# Altium project Sensor_Box_Ethernet.PrjPCB
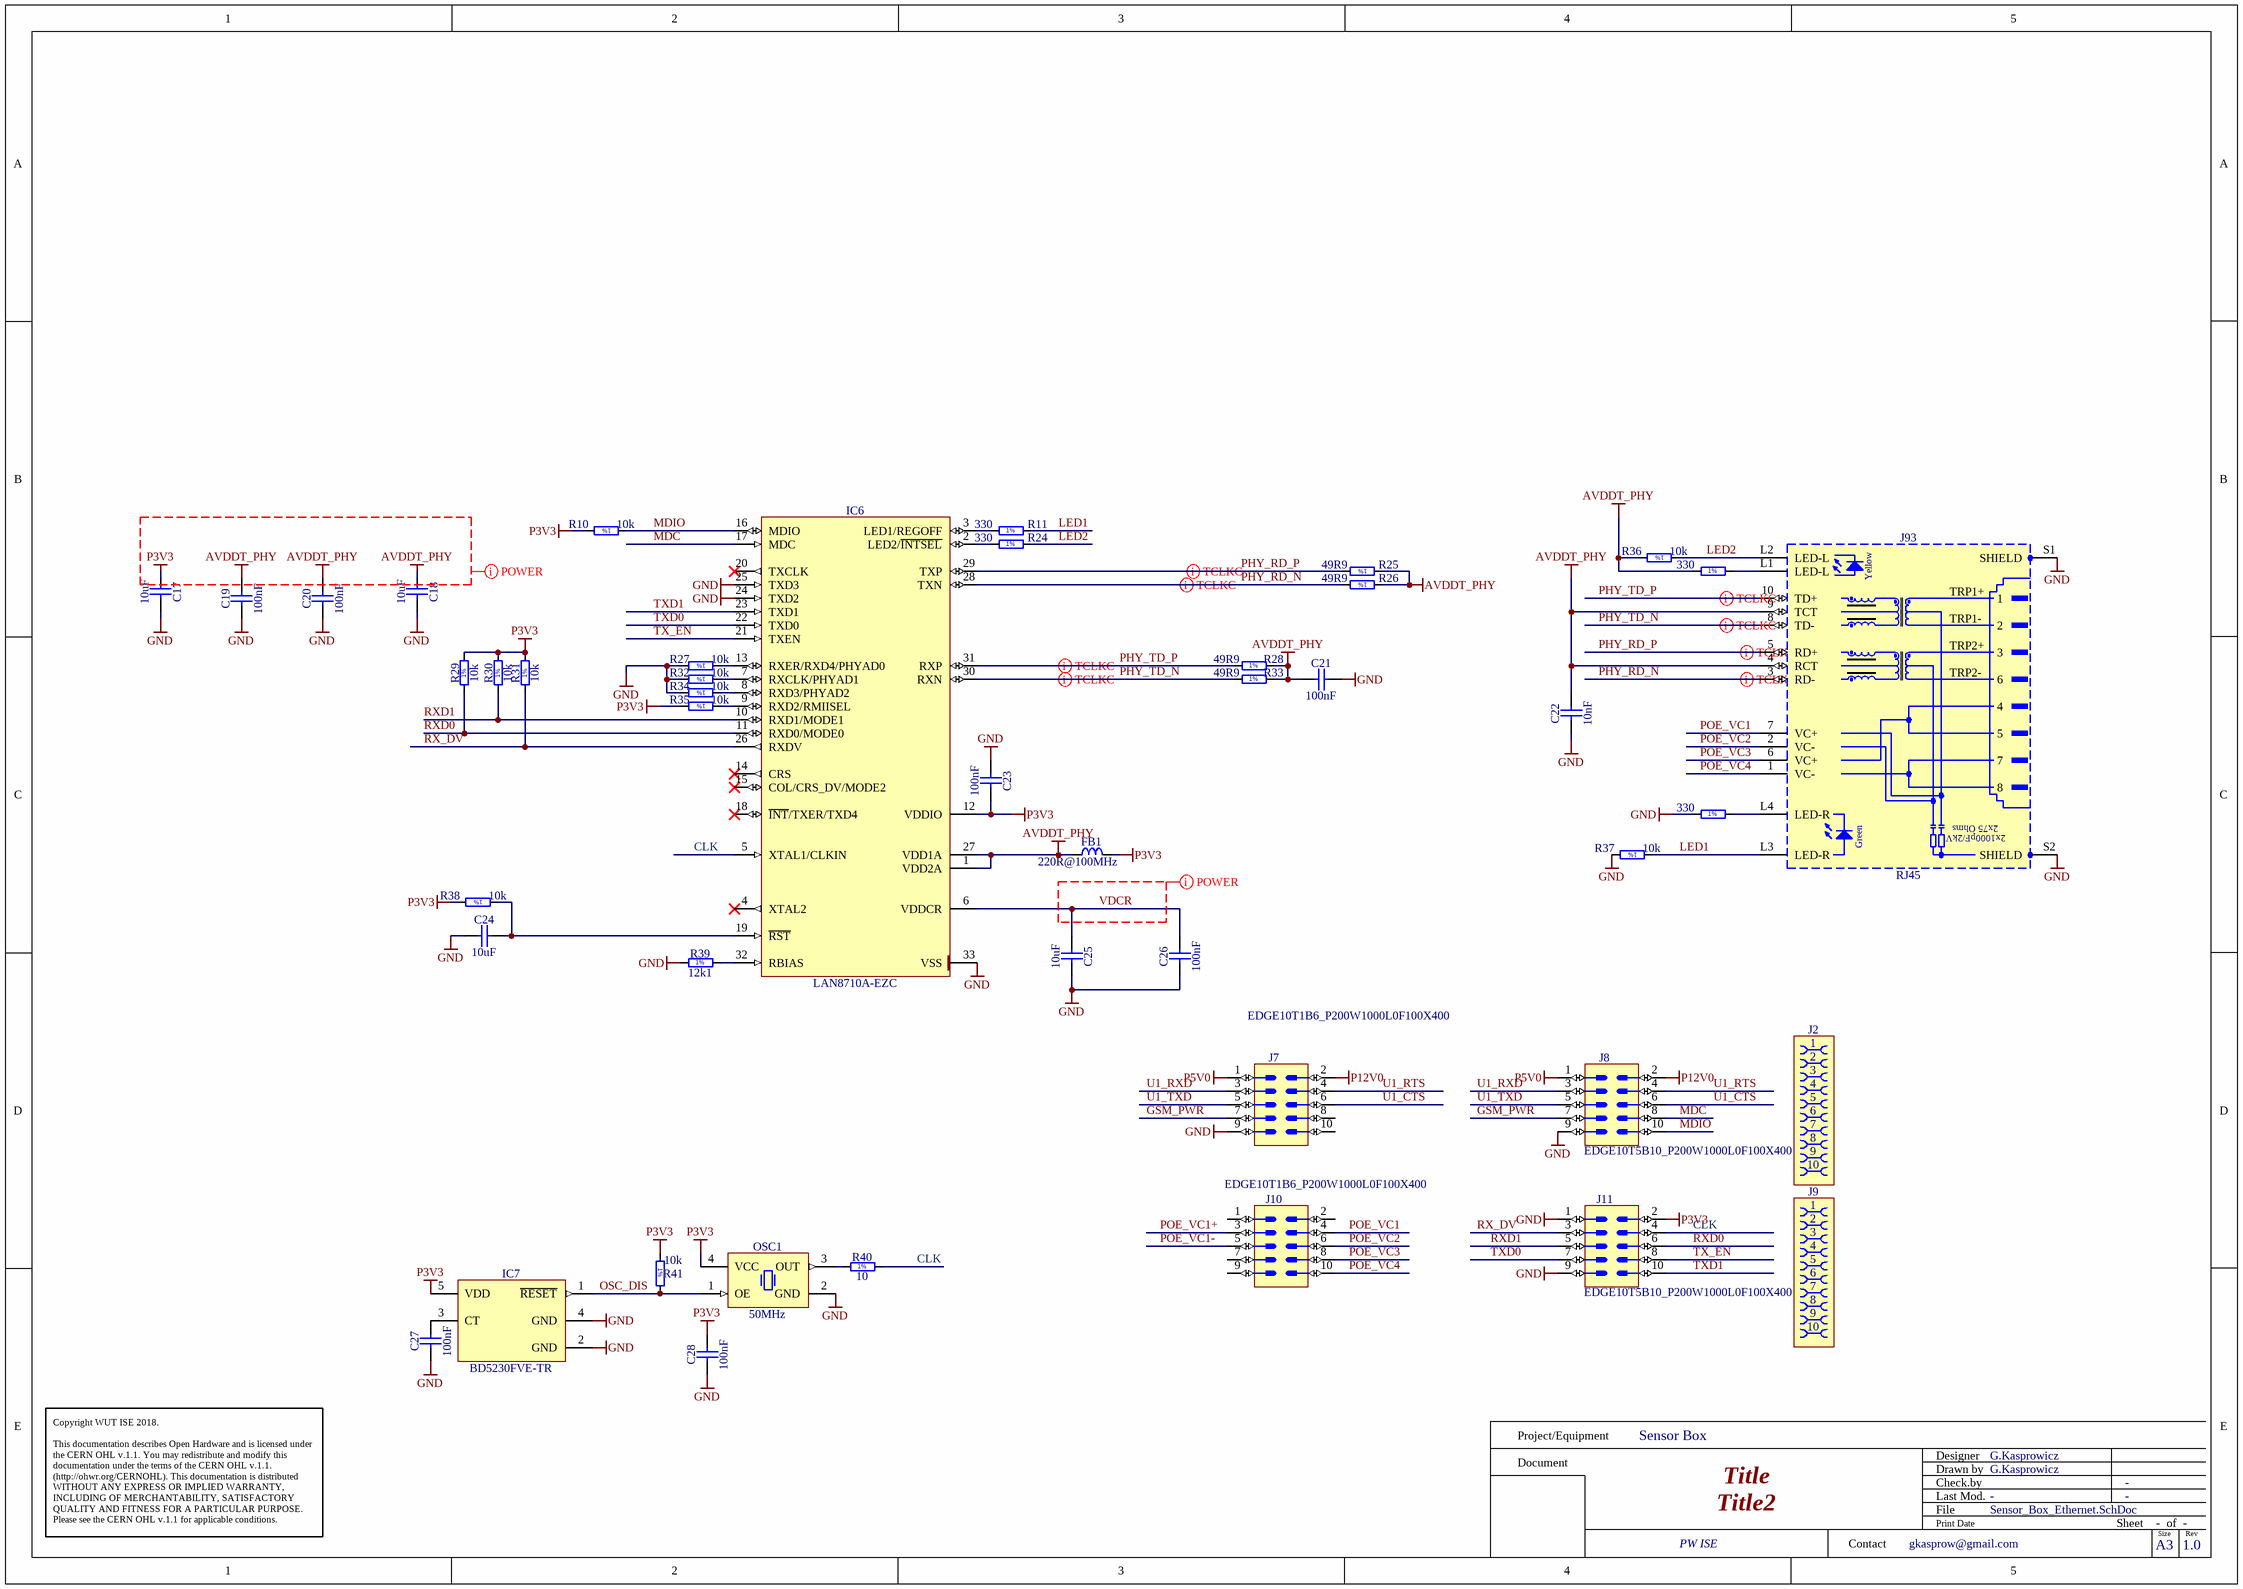
[diagram p0: Sensor_Box_Ethernet.SchDoc]
1 sheet, 45 parts. Net scope: global (net labels, ports and power ports of the same name join across sheets).
Board file: Sensor_Box_Ethernet.PCBDOC

## Sheet Sensor_Box_Ethernet.SchDoc: Title
size 420 x 297 mm; Author: G.Kasprowicz; CompanyName: WUT ISE; DrawnBy: G.Kasprowicz; Organization: WUT ISE; Address1: PW ISE; Address2: Nowowiejska 15/19 00-665 Warsaw; Address3: gkasprow@gmail.com; Revision: 1.0; SheetNumber: -; SheetTotal: -; ModifiedBy: -; CheckedDate: -; Title2: Title2; DivGrp: WUT ISE; Designer: G.Kasprowicz; ModifiedDate: -; ProjectName: Sensor Box

### Parts
C17  10uF  [CAPC2012X135N]
C18  10uF  [CAPC2012X135N]
C19  100nF  [CAPC1005X55N]
C20  100nF  [CAPC1005X55N]
C21  100nF  [CAPC1005X55N]
C22  10nF  [CAPC1608X87N]
C23  100nF  [CAPC1005X55N]
C24  10uF  [CAPC2012X135N]
C25  10uF  [CAPC2012X135N]
C26  100nF  [CAPC1005X55N]
C27  100nF  [CAPC1005X55N]
C28  100nF  [CAPC1005X55N]
FB1  220R@100MHz  [INDC2012X105N]
IC6  LAN8710A-EZC  [QFN50P500X500X100-33N-S340]
IC7  BD5230FVE-TR  [SOT95P280X145-5N]
J2  (no value)  [AVX_00 9159 010 061 916]
J7  (no value)  [EDGE10T1B6_P200W1000L0F100X400]
J8  (no value)  [EDGE10T5B10_P200W1000L0F100X400]
J9  (no value)  [AVX_00 9159 010 061 916]
J10  (no value)  [EDGE10T1B6_P200W1000L0F100X400]
J11  (no value)  [EDGE10T5B10_P200W1000L0F100X400]
J93  RJ45  [ABRACON_ARJM11C7-114-BA-EW2]
OSC1  50MHz  [OSCSC254P320X500X130-4N]
R10  10k  [RESC1005X40N]
R11  330  [RESC1005X40N]
R24  330  [RESC1005X40N]
R25  49R9  [RESC1005X40N]
R26  49R9  [RESC1005X40N]
R27  10k  [RESC1005X40N]
R28  49R9  [RESC1005X40N]
R29  10k  [RESC1005X40N]
R30  10k  [RESC1005X40N]
R31  10k  [RESC1005X40N]
R32  10k  [RESC1005X40N]
R33  49R9  [RESC1005X40N]
R34  10k  [RESC1005X40N]
R35  10k  [RESC1005X40N]
R36  10k  [RESC1005X40N]
R37  10k  [RESC1005X40N]
R38  10k  [RESC1005X40N]
R39  12k1  [RESC1005X40N]
R40  10  [RESC1005X40N]
R41  10k  [RESC1005X40N]
R85  330  [RESC1005X40N]
R86  330  [RESC1005X40N]

### Nets
AVDDT_PHY: C18.1 C19.2 C20.2 C21.1 C22.2 FB1.1 IC6.1(VDD2A) IC6.27(VDD1A) J93.4(RCT) J93.9(TCT) R25.1 R26.1 R28.2 R33.2 R36.2 R85.1
GND: C17.2 C18.2 C19.1 C20.1 C21.2 C22.1 C23.1 C24.1 C25.2 C26.1 C27.1 C28.1 IC6.24(TXD2) IC6.25(TXD3) IC6.33(VSS) IC7.2(GND) IC7.4(GND) J7.9 J8.9 J11.1 J11.9 J93.S1(SHIELD) J93.S2(SHIELD) OSC1.2(GND) R27.2 R32.2 R34.2 R37.2 R39.1 R86.1
P3V3: C17.1 C23.2 C28.2 FB1.2 IC6.12(VDDIO) IC7.5(VDD) J11.2 OSC1.4(VCC) R10.2 R29.2 R30.2 R31.2 R35.2 R38.2 R41.1
P5V0: J7.1 J8.1
P12V0: J7.2 J8.2
CLK: IC6.5(XTAL1/CLKIN) J11.4 R40.2
GSM_PWR: J7.7 J8.7
LED1: J93.L3(LED-R) R11.2 R37.1
LED2: J93.L2(LED-L) R24.2 R36.1
MDC: IC6.17(MDC) J8.8
MDIO: IC6.16(MDIO) J8.10 R10.1
OSC_DIS: IC7.1(~{RESET}) OSC1.1(OE) R41.2
PHY_RD_N: IC6.28(TXN) J93.3(RD-) R26.2
PHY_RD_P: IC6.29(TXP) J93.5(RD+) R25.2
PHY_TD_N: IC6.30(RXN) J93.8(TD-) R33.1
PHY_TD_P: IC6.31(RXP) J93.10(TD+) R28.1
POE_VC1: J10.4 J93.7(VC+)
POE_VC1+: J10.3
POE_VC1-: J10.5
POE_VC2: J10.6 J93.2(VC-)
POE_VC3: J10.8 J93.6(VC+)
POE_VC4: J10.10 J93.1(VC-)
RX_DV: IC6.26(RXDV) J11.3 R31.1
RXD0: IC6.11(RXD0/MODE0) J11.6 R29.1
RXD1: IC6.10(RXD1/MODE1) J11.5 R30.1
TX_EN: IC6.21(TXEN) J11.8
TXD0: IC6.22(TXD0) J11.7
TXD1: IC6.23(TXD1) J11.10
U1_CTS: J7.6 J8.6
U1_RTS: J7.4 J8.4
U1_RXD: J7.3 J8.3
U1_TXD: J7.5 J8.5
VDCR: C25.1 C26.2 IC6.6(VDDCR)
NetC24_2: C24.2 IC6.19(~{RST}) R38.1
NetC27_2: C27.2 IC7.3(CT)
NetIC6_2: IC6.2(LED2/~{INTSEL}) R24.1
NetIC6_3: IC6.3(LED1/REGOFF) R11.1
NetIC6_7: IC6.7(RXCLK/PHYAD1) R32.1
NetIC6_8: IC6.8(RXD3/PHYAD2) R34.1
NetIC6_9: IC6.9(RXD2/RMIISEL) R35.1
NetIC6_13: IC6.13(RXER/RXD4/PHYAD0) R27.1
NetIC6_32: IC6.32(RBIAS) R39.2
NetJ93_L1: J93.L1(LED-L) R85.2
NetJ93_L4: J93.L4(LED-R) R86.2
NetOSC1_3: OSC1.3(OUT) R40.1

Not connected (* = marked no-connect by the designer): IC6 4(XTAL2)* 14(CRS)* 15(COL/CRS_DV/MODE2)* 18(~{INT}/TXER/TXD4)* 20(TXCLK)*; J7 8 10; J10 1 2 7 9

### Layout directives
differential pair: PHY_RD_N, PHY_RD_P, PHY_TD_N, PHY_TD_P
net class POWER: AVDDT_PHY, P3V3, VDCR

### Notes on the sheet
- Project/Equipment
- Document
- Designer
- Drawn by
- Check.by
- Copyright WUT ISE 2018.
  This documentation describes Open Hardware and is licensed under the CERN OHL v.1.1. You may redistribute and modify this documentation under the terms of the CERN OHL v.1.1. (http://ohwr.org/CERNOHL). This documentation is distributed WITHOUT ANY EXPRESS OR IMPLIED WARRANTY, INCLUDING OF MERCHANTABILITY, SATISFACTORY QUALITY AND FITNESS FOR A PARTICULAR PURPOSE. Please see the CERN OHL v.1.1 for applicable conditions.
- Contact
- File
- Last Mod.
- Print Date
- Sheet
- Size
- A3
- of
- Rev
- (in symbol CON_ETH_POE_ARJM11C7) Yellow; TRP1+; TRP1-; TRP2+; TRP2-; 2x75 Ohms; Green; 2x1000pF/2kV
- (in symbol R0402_10K_1%_0.0625W_100PPM) 1%
- (in symbol R0402_10R_1%_0.0625W_200PPM) 1%
- (in symbol R0402_12K1_1%_0.0625W_100PPM) 1%
- (in symbol R0402_49R9_1%_0.0625W_100PPM) 1%
- (in symbol R0402_330R_1%_0.0625W_100PPM) 1%

### Library data of the parts
C17 C18 C24 C25 = CC0805_10UF_16V_10%_X5R: Non-polarised capacitor; Part Description: SMD Multilayer Chip Ceramic Capacitor; Manufacturer: GENERIC; Manufacturer1 Part Number: C0805C106K4PAC; Voltage: 16V; TC: X5R; Tolerance: ±10%; Part Number: CC0805_10UF_16V_10%_X5R; Component Kind: Standard; Component Type: Standard; Pin Count: 2; Value: 10uF; Status: Preferred; Manufacturer Part Number: CC0805_10UF_16V_10%_X5R; Case: 0805; Mounted: Yes; Socket: No; SMD: Yes; Manufacturer1 Example: KEMET; Manufacturer1 ComponentHeight: 1.4mm; HelpURL: \\cern.ch\dfs\Applications\Altium\Datasheets\CC1206_X5R_KEMET.pdf; Author: CERN DEM JLC; CreateDate: 03.12.2007; LatestRevisionDate: 03.12.2007; Sense: No
C19-C21 C23 C26-C28 = CC0402_100NF_16V_10%_X5R: Non-polarised capacitor; Part Description: SMD Multilayer Chip Ceramic Capacitor; Manufacturer: GENERIC; Manufacturer1 Part Number: GRM155R61C104KA88D; Voltage: 16V; TC: X5R; Tolerance: ±10%; Part Number: CC0402_100NF_16V_10%_X5R; Component Kind: Standard; Component Type: Standard; Pin Count: 2; Value: 100nF; Status: None; Manufacturer Part Number: CC0402_100NF_16V_10%_X5R; Case: 0402; Mounted: Yes; Socket: No; SMD: Yes; Manufacturer1 Example: MURATA; Manufacturer1 ComponentHeight: 0.55mm; HelpURL: \\cern.ch\dfs\Applications\Altium\Datasheets\CC0402_X5R_MURATA_GRM.pdf; Author: CERN DEM JLC; CreateDate: 10.12.2013; LatestRevisionDate: 10.12.2013; Sense: No
C22 = CC0603_10NF_50V_5%_C0G: Non-polarised capacitor; Part Description: SMD Multilayer Chip Ceramic Capacitor; Manufacturer: GENERIC; Manufacturer1 Part Number: C1608C0G1H103J080AA; Voltage: 50V; TC: C0G/NP0; Tolerance: ±5%; Part Number: CC0603_10NF_50V_5%_C0G; Component Kind: Standard; Component Type: Standard; Pin Count: 2; Value: 10nF; Status: Preferred; Manufacturer Part Number: CC0603_10NF_50V_5%_C0G; Case: 0603; Mounted: Yes; Socket: No; SMD: Yes; Sense: No; Manufacturer1 Example: TDK; Manufacturer1 ComponentHeight: 0.9mm; HelpURL: \\cern.ch\dfs\Applications\Altium\Datasheets\CC0603_C0G_TDK_C.pdf; Author: CERN DEM JLC; CreateDate: 10.12.2014; LatestRevisionDate: 10.12.2014
FB1 = IND0805_MURATA_BLM21PG221SN1D: Inductor; Part Description: SMD EMIFIL Suppression Chip Ferrite Bead; Manufacturer: MURATA; Power: 2A; Resistance: 0.05R; Tolerance: ±25%; Table: Inductors SMD; Part Number: IND0805_MURATA_BLM21PG221SN1D; Component Kind: Standard; Component Type: Standard; Pin Count: 2; Value: 220R@100MHz; Status: None; Manufacturer Part Number: BLM21PG221SN1D; Case: 0805; Mounted: Yes; Socket: No; SMD: Yes; ComponentHeight: 1.05mm; HelpURL: \\cern.ch\dfs\Applications\Altium\Datasheets\IND0402_MURATA_BLM21P.pdf; Author: CERN DEM JLC; CreateDate: 2010-01-25; LatestRevisionDate: 2010-01-25
IC6 = LAN8710A-EZC: Small Footprint MII/RMII 10/100 Ethernet Transceiver with HP Auto-MDIX and flexPWR® Technology; Manufacturer: MICROCHIP TECHNOLOGY; PressFit: No; Bonding: No; Part Number: LAN8710A-EZC; Component Kind: Standard; Component Type: Standard; Device: LAN8710A-EZC; PackageDescription: QFN, 0.50mm Pitch,square; 8 pin X 8 pin, 5mm X 5mm X 1.00mm H body (w/thermal tab 3.40 X 3.40mm),  IPC Medium Density; Part Description: Small Footprint MII/RMII 10/100 Ethernet Transceiver with HP Auto-MDIX and flexPWR® Technology; Manufacturer Part Number: LAN8710A-EZC; Pin Count: 33; Case: QFN32; Mounted: Yes; Socket: No; SMD: Yes; Sense: No; ComponentHeight: 1mm; Author: CERN DEM MR; HelpURL: \\cern.ch\dfs\Applications\Altium\Datasheets\LAN8710A-EZC.pdf; CreateDate: 13.02.2018; LatestRevisionDate: 13.02.2018
IC7 = VMON_BD5230FVE-TR: Free Delay Time Setting  CMOS Voltage Detector; Part Description: 5V, Low Quiescent Current, Programmable-Delay Supervisory Circuit; Manufacturer: Rohm; PressFit: No; Bonding: No; Part Number: BD5230FVE-TR; Component Kind: Standard; Component Type: Standard; Device: BD5230FVE-TR; PackageDescription: SOT23, 5-Leads, Body 1.6x3.0mm, Pitch 0.95mm, IPC Medium Density; Manufacturer Part Number: BD5230FVE-TR; Pin Count: 5; Case: SOT23-5; Mounted: Yes; Socket: No; SMD: Yes; Sense: No; ComponentHeight: 1.45mm; Author: GK; HelpURL: \\cern.ch\dfs\Applications\Altium\Datasheets\TPS3808G50DBVT.pdf; CreateDate: 02.03.2015; LatestRevisionDate: 02.03.2015
J2 J9 = AVX_00 9159 010 061 916: Open Ended Card Edge Connector, 9159 Series; Part Description: 10 Contacts, 2mm Pitch, Open Ended Card Edge Connector, 9159 Series; Manufacturer: AVX; PressFit: No; Part Number: AVX_00 9159 010 061 916; Component Kind: Standard; Component Type: Standard; Pin Count: 10; Mounted: Yes; Socket: No; SMD: No; Sense: No; Status: None; Manufacturer Part Number: 00 9159 010 061 916; ComponentHeight: 1.6mm; HelpURL: \\cern.ch\dfs\Applications\Altium\Datasheets\AVX_00 9159 010 061 916.pdf; Author: CERN DEM MR; CreateDate: 13.02.2018; LatestRevisionDate: 13.02.2018
J7 J10 = EDGE10T1B6_P200W1000L0F100X400: PCB Edge Connector 10 (2x5); Part Description: 10 Contacts Board Edge Connector, Pitch 2mm, Length 0mm, Width 10mm, Finger Lenght 4mm, Finger Width 1mm; Mounted: No; PressFit: No; Part Number: EDGE10T1B6_P200W1000L0F100X400; Component Kind: Standard (No BOM); Component Type: Standard (No BOM); Pin Count: 10; Socket: No; SMD: No; Sense: No; Status: None; ComponentHeight: 0mm; HelpURL: \\cern.ch\dfs\Applications\Altium\Datasheets\EDGE10T1B6_P200W1000L0F100X400.pdf; Author: CERN DEM MR; CreateDate: 14.02.2018; LatestRevisionDate: 14.02.2018
J8 J11 = EDGE10T5B10_P200W1000L0F100X400: PCB Edge Connector 10 (2x5); Part Description: 10 Contacts Board Edge Connector, Pitch 2mm, Length 0mm, Width 10mm, Finger Lenght 4mm, Finger Width 1mm; Mounted: No; PressFit: No; Part Number: EDGE10T5B10_P200W1000L0F100X400; Component Kind: Standard (No BOM); Component Type: Standard (No BOM); Pin Count: 10; Socket: No; SMD: No; Sense: No; Status: None; ComponentHeight: 0mm; HelpURL: \\cern.ch\dfs\Applications\Altium\Datasheets\EDGE10T5B10_P200W1000L0F100X400.pdf; Author: CERN DEM MR; CreateDate: 14.02.2018; LatestRevisionDate: 14.02.2018
J93 = CON_ETH_POE_ARJM11C7: MagJack 10/100BaseT, PoE+, 1X1, OG/Y, -40 to 85*C, Tab Up, RoHS; Part Number: ARJM11C7-114-BA-EW2; Part Description: 1 Port, Orange Green/Yellow LEDs, RJ45 10/100BaseT, PoE, Ethernet MagJack® Connector Module; Manufacturer: Abracon; PressFit: No; Component Kind: Standard; Component Type: Standard; Pin Count: 18; Family: RJ45; Mounted: Yes; Socket: No; SMD: No; Sense: No; Status: None; Manufacturer Part Number: ARJM11C7-114-BA-EW2; ComponentHeight: 13.61mm; HelpURL: \\cern.ch\dfs\Applications\Altium\Datasheets\BELFUSE_0826-1X1T-GJ-F.pdf; Author: GK; CreateDate: 05.11.2012; LatestRevisionDate: 05.11.2012
OSC1 = OSC_50MHZ_CTS_636L3I050M00000: Oscillator 4 pins 1=OE 2=GND 3=OUT 4=VCC; Part Description: 3.3V, ±50ppm, 30pF, -40..85°C, HCMOS/TTL Clock Oscillator, 636 Series; Manufacturer: CTS ELECTRONIC COMPONENTS; PressFit: No; Bonding: No; Part Number: OSC_50MHZ_CTS_636L3I050M00000; Component Kind: Standard; Component Type: Standard; PackageDescription: Oscillator, Side Concave; 2.54mm Pitch; 4 pin, 3.20mm L X 5.00mm W X 1.30mm H, IPC Medium Density; Value: 50MHz; Manufacturer Part Number: 636L3I050M00000; Pin Count: 4; Mounted: Yes; Socket: No; SMD: Yes; Sense: No; ComponentHeight: 1.3mm; HelpURL: \\cern.ch\dfs\Applications\Altium\Datasheets\OSC_CTS_636.pdf; Author: CERN DEM JMW; CreateDate: 22.09.2015; LatestRevisionDate: 22.09.2015
R10 R27 R29-R32 R34-R38 R41 = R0402_10K_1%_0.0625W_100PPM: Resistor - 1%; Part Description: General Purpose Thick Film Chip Resistor; Manufacturer: GENERIC; Manufacturer1 Part Number: 232270671003L; TC: ±100ppm/°C; Table: Resistors SMD; Part Number: R0402_10K_1%_0.0625W_100PPM; Component Kind: Standard; Component Type: Standard; Pin Count: 2; Value: 10k; Status: Not recommended; Power: 0.0625W; Tolerance: ±1%; Manufacturer Part Number: R0402_10K_1%_0.0625W_100PPM; Case: 0402; Mounted: Yes; Socket: No; SMD: Yes; Manufacturer1 Example: YAGEO PHYCOMP; Manufacturer1 ComponentHeight: 0.4mm; HelpURL: \\cern.ch\dfs\Applications\Altium\Datasheets\R0402_Phycomp_RC0402.pdf; Author: CERN DEM JLC; CreateDate: 2007-12-03; LatestRevisionDate: 2012-10-17
R11 R24 R85 R86 = R0402_330R_1%_0.0625W_100PPM: Resistor - 1%; Part Description: General Purpose Thick Film Chip Resistor; Manufacturer: GENERIC; Manufacturer1 Part Number: 232270673301L; TC: ±100ppm/°C; PressFit: No; Part Number: R0402_330R_1%_0.0625W_100PPM; Component Kind: Standard; Component Type: Standard; Pin Count: 2; Value: 330; Status: Not Recommended; Power: 0.0625W; Tolerance: ±1%; Manufacturer Part Number: R0402_330R_1%_0.0625W_100PPM; Case: 0402; Mounted: Yes; Sense: No; Socket: No; SMD: Yes; Manufacturer1 Example: YAGEO PHYCOMP; Manufacturer1 ComponentHeight: 0.4mm; HelpURL: \\cern.ch\dfs\Applications\Altium\Datasheets\R0402_Phycomp_RC0402.pdf; Author: CERN DEM JLC; CreateDate: 03.12.2007; LatestRevisionDate: 17.10.2012
R25 R26 R28 R33 = R0402_49R9_1%_0.0625W_100PPM: Resistor - 1%; Part Description: General Purpose Thick Film Chip Resistor; Manufacturer: GENERIC; Manufacturer1 Part Number: 232270674999L or RC0402FR-0749R9L; TC: ±100ppm/°C; Table: Resistors SMD; Part Number: R0402_49R9_1%_0.0625W_100PPM; Component Kind: Standard; Component Type: Standard; Pin Count: 2; Value: 49R9; Status: Not recommended; Power: 0.0625W; Tolerance: ±1%; Manufacturer Part Number: R0402_49R9_1%_0.0625W_100PPM; Case: 0402; Mounted: Yes; Socket: No; SMD: Yes; Manufacturer1 Example: YAGEO PHYCOMP; Manufacturer1 ComponentHeight: 0.4mm; HelpURL: \\cern.ch\dfs\Applications\Altium\Datasheets\R0402_Phycomp_RC0402.pdf; Author: CERN DEM JLC; CreateDate: 2012-10-24; LatestRevisionDate: 2012-10-24
R39 = R0402_12K1_1%_0.0625W_100PPM: Resistor - 1%; Part Description: General Purpose Thick Film Chip Resistor; Manufacturer: GENERIC; Manufacturer1 Part Number: 232270671213L or RC0402FR-0712K1L; TC: ±100ppm/°C; Table: Resistors SMD; Part Number: R0402_12K1_1%_0.0625W_100PPM; Component Kind: Standard; Component Type: Standard; Pin Count: 2; Value: 12k1; Status: Not recommended; Power: 0.0625W; Tolerance: ±1%; Manufacturer Part Number: R0402_12K1_1%_0.0625W_100PPM; Case: 0402; Mounted: Yes; Socket: No; SMD: Yes; Manufacturer1 Example: YAGEO PHYCOMP; Manufacturer1 ComponentHeight: 0.4mm; HelpURL: \\cern.ch\dfs\Applications\Altium\Datasheets\R0402_Phycomp_RC0402.pdf; Author: CERN DEM JLC; CreateDate: 2012-10-24; LatestRevisionDate: 2012-10-24
R40 = R0402_10R_1%_0.0625W_200PPM: Resistor - 1%; Part Description: General Purpose Thick Film Chip Resistor; Manufacturer: GENERIC; Manufacturer1 Part Number: 232270671009L; TC: ±200ppm/°C; PressFit: No; Part Number: R0402_10R_1%_0.0625W_200PPM; Component Kind: Standard; Component Type: Standard; Pin Count: 2; Value: 10; Status: Not Recommended; Power: 0.0625W; Tolerance: ±1%; Manufacturer Part Number: R0402_10R_1%_0.0625W_200PPM; Case: 0402; Mounted: Yes; Sense: No; Socket: No; SMD: Yes; Manufacturer1 Example: YAGEO PHYCOMP; Manufacturer1 ComponentHeight: 0.4mm; HelpURL: \\cern.ch\dfs\Applications\Altium\Datasheets\R0402_Phycomp_RC0402.pdf; Author: CERN DEM JLC; CreateDate: 24.06.2009; LatestRevisionDate: 17.10.2012